# EAGLE design Netfrequency (EAGLE 6.1)
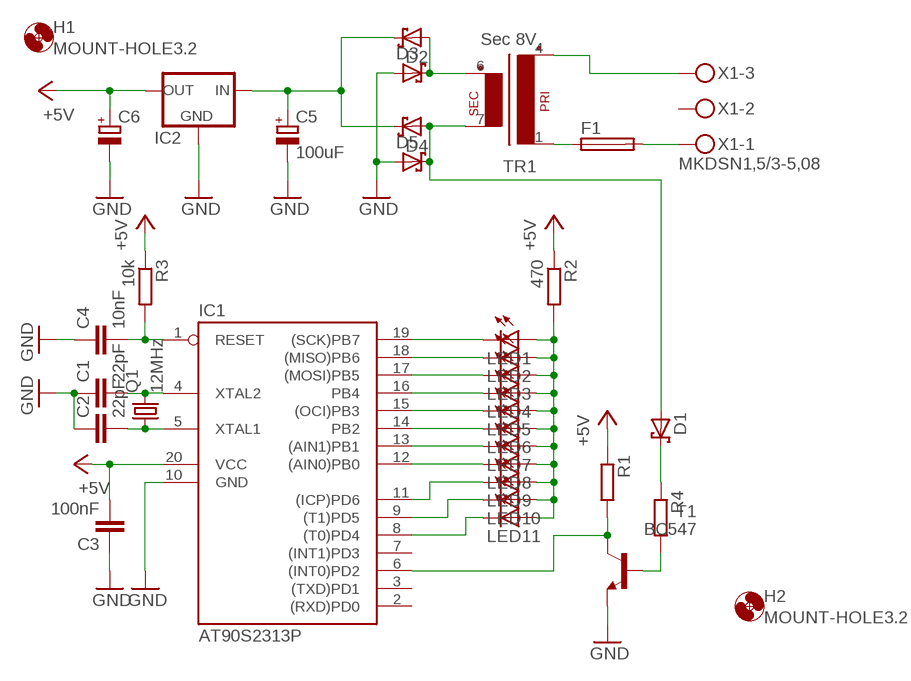
[diagram p0: schematic, sheet 1]

## Parts
C1  22pF  C-EU025-025X050  [C025-025X050]
C2  22pF  C-EU025-025X050  [C025-025X050]
C3  100nF  C-EU025-025X050  [C025-025X050]
C4  10nF  C-EU025-025X050  [C025-025X050]
C5  100uF  CPOL-EUE5-8.5  [E5-8,5]
C6  CPOL-EUE2.5-6  [E2,5-6]
D1  SCHOTTKY-DIODEDO35-7  [DO35-7]
D2  SCHOTTKY-DIODEDO35-7  [DO35-7]
D3  SCHOTTKY-DIODEDO35-7  [DO35-7]
D4  SCHOTTKY-DIODEDO35-7  [DO35-7]
D5  SCHOTTKY-DIODEDO35-7  [DO35-7]
F1  SH22  [SH22]
H1  MOUNT-HOLE3.2  [3,2]
H2  MOUNT-HOLE3.2  [3,2]
IC1  AT90S2313P  [DIL20]
IC2  78LXX  [78LXX]
LED1  LEDSQR2X5  [LED2X5]
LED2  LEDSQR2X5  [LED2X5]
LED3  LEDSQR2X5  [LED2X5]
LED4  LEDSQR2X5  [LED2X5]
LED5  LEDSQR2X5  [LED2X5]
LED6  LEDSQR2X5  [LED2X5]
LED7  LEDSQR2X5  [LED2X5]
LED8  LEDSQR2X5  [LED2X5]
LED9  LEDSQR2X5  [LED2X5]
LED10  LEDSQR2X5  [LED2X5]
LED11  LEDSQR2X5  [LED2X5]
Q1  12MHz  CRYSTALHC49S  [HC49/S]
R1  R-EU_0204/7  [0204/7]
R2  470  R-EU_0204/7  [0204/7]
R3  10k  R-EU_0204/7  [0204/7]
R4  R-EU_0204/7  [0204/7]
T1  BC547  [TO92]
TR1  Sec 8V  EE20-1  [EE20-1]
X1  MKDSN1,5/3-5,08  [MKDSN1,5/3-5,08]

## Nets
+5V: C3.2 C6.+ IC1.20(VCC) IC2.OUT R1.1 R2.1 R3.1
GND: C1.1 C2.1 C3.1 C4.1 C5.- C6.- D3.A D5.A IC1.10(GND) IC2.GND T1.1(E)
N$1: IC1.19((SCK)PB7) LED1.K(C)
N$2: IC1.18((MISO)PB6) LED2.K(C)
N$3: IC1.17((MOSI)PB5) LED3.K(C)
N$4: IC1.16(PB4) LED4.K(C)
N$5: IC1.15((OCI)PB3) LED5.K(C)
N$6: IC1.14(PB2) LED6.K(C)
N$7: IC1.13((AIN1)PB1) LED7.K(C)
N$8: IC1.12((AIN0)PB0) LED8.K(C)
N$9: IC1.11((ICP)PD6) LED9.K(C)
N$10: IC1.9((T1)PD5) LED10.K(C)
N$11: IC1.8((T0)PD4) LED11.K(C)
N$12: LED1.A LED2.A LED3.A LED4.A LED5.A LED6.A LED7.A LED8.A LED9.A LED10.A LED11.A R2.2
N$13: C1.2 IC1.4(XTAL2) Q1.2
N$14: C2.2 IC1.5(XTAL1) Q1.1
N$15: C4.2 IC1.1(RESET) R3.2
N$16: IC1.6((INT0)PD2) R1.2 T1.3(C)
N$17: D2.A D3.C TR1.6(S3)
N$19: C5.+ D2.C D4.C IC2.IN
N$20: F1.1 TR1.1
N$21: F1.2 X1.1
N$22: TR1.4(P2) X1.3
N$23: R4.2 T1.2(B)
N$24: D1.C R4.1
N$25: D1.A D4.A D5.C TR1.7(S4)
Unconnected: IC1.2((RXD)PD0) IC1.3((TXD)PD1) IC1.7((INT1)PD3) X1.2

## Library data of the parts
C1-C4 = rcl:C-EU: CAPACITOR, European symbol
C5 C6 = rcl:CPOL-EU: POLARIZED CAPACITOR, European symbol
D1-D5 = diode:SCHOTTKY-DIODE: Schottky Diode
F1 = fuse:SH22: FUSE HOLDER CS PFP30, Schukat; OC_FARNELL: unknown; OC_NEWARK: unknown
H1 H2 = holes:MOUNT-HOLE: MOUNTING HOLE with drill center marker
IC1 = atmel:AT90S2313: MICROCONTROLLER 2 Kbytes FLASH 128 bytes SRAM 128 bytes EEPROM UART; OC_FARNELL: unknown; OC_NEWARK: unknown
IC2 = v-reg:78LXX: VOLTAGE REGULATOR
LED1-LED11 = led:LED: LED OSRAM: - CHIPLED LG R971, LG N971, LY N971, LG Q971, LY Q971, LO R971, LY R971 LH N974, LH R974 LS Q976, LO Q976, LY Q976 LO Q996 - Hyper CHIPLED LW Q18S LB Q993, LB Q99A, LB R99A - SideLED LS A670, LO A670, LY A670, LG A670, LP A670 LB A673, LV A673, LT A673, LW A673 LH A674 LY A675 LS A676, LA A676, LO A676, LY A676, LW A676 LS A679, LY A679, LG A679 - Hyper Micro SIDELED® LS Y876, LA Y876, LO Y876, LY Y876 LT Y87S - SmartLED LW L88C, LW L88S LB L89C, LB L89S, LG L890 LS L89K, LO L89K, LY L89K LS L896, LA L896, LO L896, LY L896 - TOPLED LS T670, LO T670, LY T670, LG T670, LP T670 LSG T670, LSP T670, LSY T670, LOP T670, LYG T670 LG T671, LOG T671, LSG T671 LB T673, LV T673, LT T673, LW T673 LH T674 LS T676, LA T676, LO T676, LY T676, LB T676, LH T676, LSB T676, LW T676 LB T67C, LV T67C, LT T67C, LS T67K, LO T67K, LY T67K, LW E67C LS E67B, LA E67B, LO E67B, LY E67B, LB E67C, LV E67C, LT E67C LW T67C LS T679, LY T679, LG T679 LS T770, LO T770, LY T770, LG T770, LP T770 LB T773, LV T773, LT T773, LW T773 LH T774 LS E675, LA E675, LY E675, LS T675 LS T776, LA T776, LO T776, LY T776, LB T776 LHGB T686 LT T68C, LB T68C - Hyper Mini TOPLED® LB M676 - Mini TOPLED Santana® LG M470 LS M47K, LO M47K, LY M47K Source: http://www.osram.convergy.de LUXEON: - LUMILED® LXK2-PW12-R00, LXK2-PW12-S00, LXK2-PW14-U00, LXK2-PW14-V00 LXK2-PM12-R00, LXK2-PM12-S00, LXK2-PM14-U00 LXK2-PE12-Q00, LXK2-PE12-R00, LXK2-PE12-S00, LXK2-PE14-T00, LXK2-PE14-U00 LXK2-PB12-K00, LXK2-PB12-L00, LXK2-PB12-M00, LXK2-PB14-N00, LXK2-PB14-P00, LXK2-PB14-Q00 LXK2-PR12-L00, LXK2-PR12-M00, LXK2-PR14-Q00, LXK2-PR14-R00 LXK2-PD12-Q00, LXK2-PD12-R00, LXK2-PD12-S00 LXK2-PH12-R00, LXK2-PH12-S00 LXK2-PL12-P00, LXK2-PL12-Q00, LXK2-PL12-R00 Source: www.luxeon.com KINGBRIGHT: KA-3528ASYC Source: www.kingbright.com
Q1 = crystal:CRYSTAL: CRYSTAL; OC_FARNELL: 1667008; OC_NEWARK: unknown
R1-R4 = rcl:R-EU_: RESISTOR, European symbol
T1 = transistor:BC547: NPN TRANSISTOR
TR1 = trafo:EE20-1: TRANSFORMER 1 primary winding, 1 secondary winding ERA
X1 = con-phoenix-508:MKDSN1,5/3-5,08: MKDSN 1,5/ 3-5,08 Printklemme Nennstrom: 13,5 A Nennspannung: 250 V Rastermaß: 5,08 mm Polzahl: 3 Anschlussart: Schraubanschluss Montage: Löten Anschlussrichtung Leiter/Platine: 0 ° Artikelnummer: 1729131 Source: http://eshop.phoenixcontact.com .. 1729131.pdf; MPN: SMKDSN1,5/3-5,08; OC_FARNELL: 1792904; OC_NEWARK: 70R0299

## Board
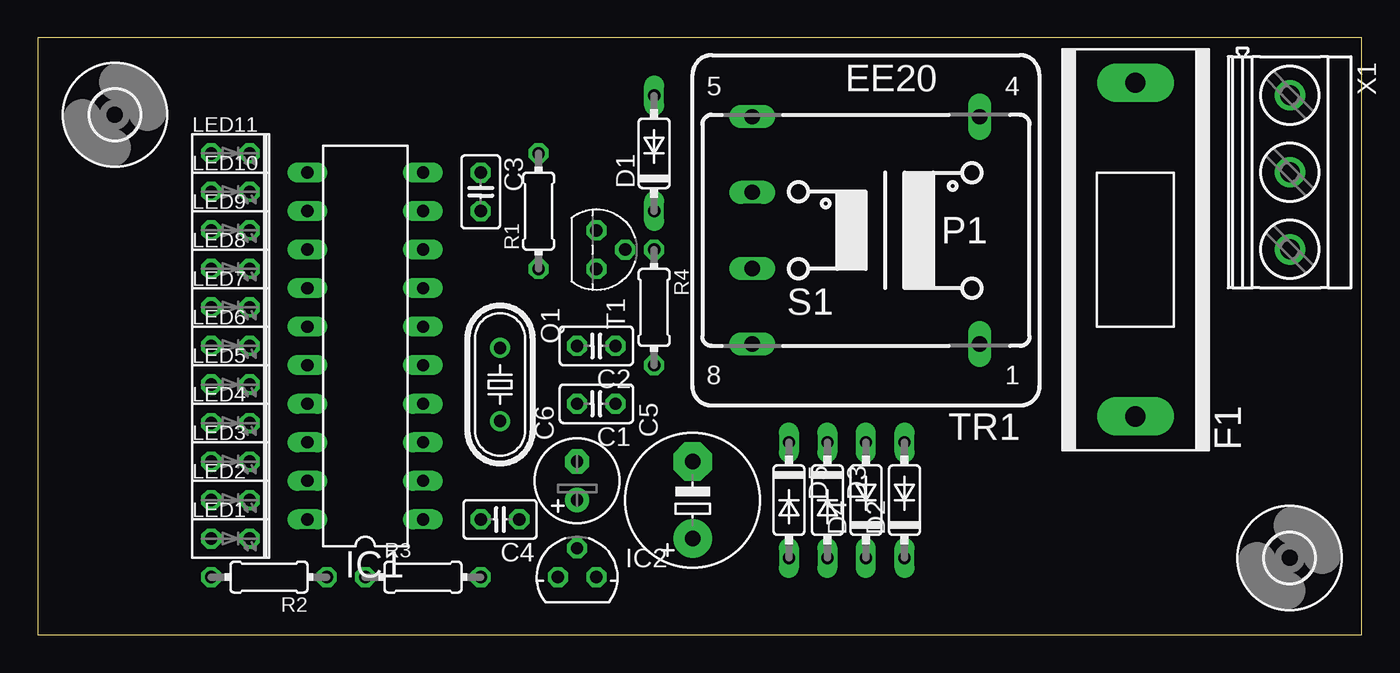
[diagram p1: board, top side]
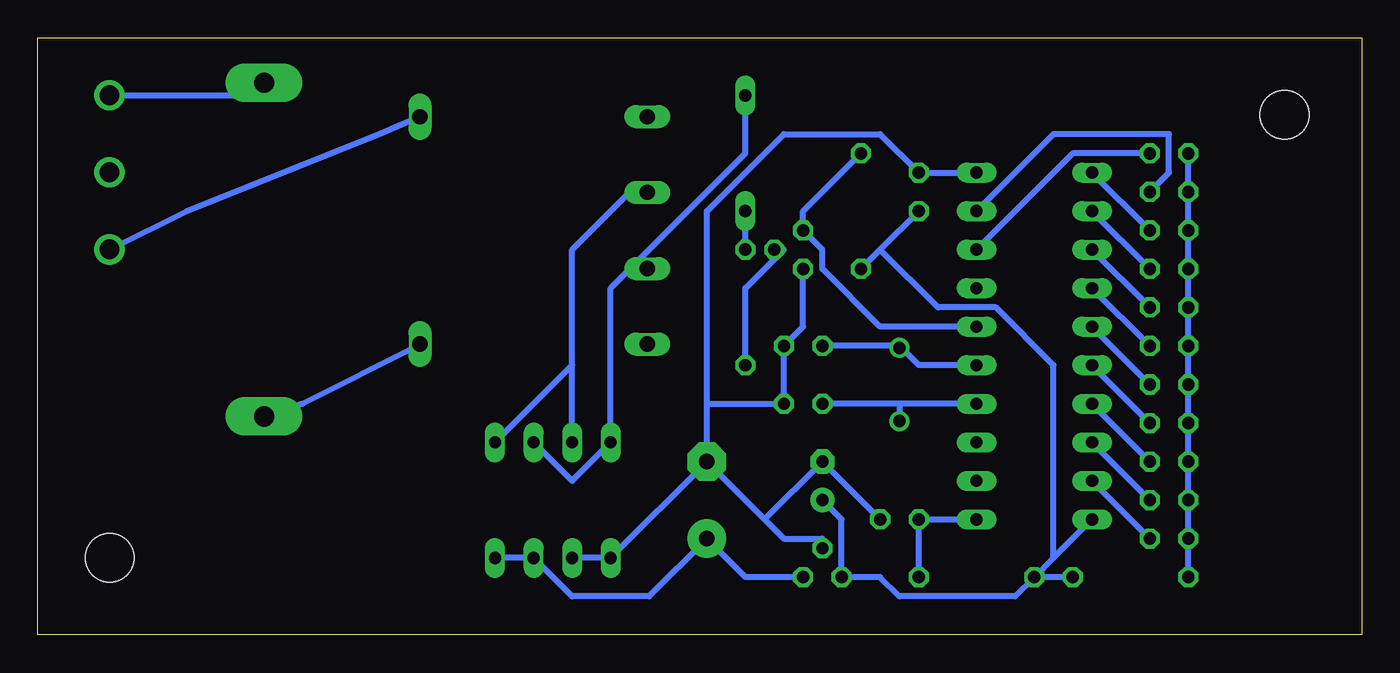
[diagram p2: board, bottom side, seen from below]

Size 87.3 x 39.36 mm. Coordinates in mm from the lower left corner, seen from the top.
Outline: 0,0 87.3,0 87.3,39.36 0,39.36 0,0
Copper layers (1*16): Top 0.035mm / dielectric 1.5mm / Bottom 0.035mm
Design rules: minimum track width 16mil, minimum drill 24mil, track to track 16mil, track to pad 16mil, pad to pad 16mil, via to via 16mil, smd to smd 8mil, copper to edge 40mil, drill to drill 16mil, minimum pad ring 10mil, minimum via ring 8mil, stop-mask expansion 4mil, vias tented up to drill 0mil, thermal gap 10mil

### Footprints (pad centres in the part's own frame; a part is rotated, then mirrored left to right if it is on the bottom)
C025-025X050 = drill 0.813 octagon: 1 -1.27,0; 2 1.27,0
E5-8,5 = drill 1.016 pad 2.54: + -2.54,0 | drill 1.016 pad 2.54 octagon: - 2.54,0
E2,5-6 = drill 0.813 pad 1.6: + -1.27,0 | drill 0.813 pad 1.6 octagon: - 1.27,0
DO35-7 = drill 0.813 long: A 3.81,0; C -3.81,0
SH22 = drill 1.321 pad 2.54 long: 1 -10.998,0; 2 10.998,0
3,2 = hole 3.2: 0,0
DIL20 = drill 0.813 long: 1 -11.43,-3.81; 2 -8.89,-3.81; 3 -6.35,-3.81; 4 -3.81,-3.81; 5 -1.27,-3.81; 6 1.27,-3.81; 7 3.81,-3.81; 8 6.35,-3.81; 9 8.89,-3.81; 10 11.43,-3.81; 11 11.43,3.81; 12 8.89,3.81; 13 6.35,3.81; 14 3.81,3.81; 15 1.27,3.81; 16 -1.27,3.81; 17 -3.81,3.81; 18 -6.35,3.81; 19 -8.89,3.81; 20 -11.43,3.81
78LXX = drill 0.813 octagon: GND 0,1.905; IN 1.27,0; OUT -1.27,0
LED2X5 = drill 0.813 octagon: A -1.27,0; K 1.27,0
HC49/S = drill 0.813: 1 -2.413,0; 2 2.413,0
0204/7 = drill 0.813 octagon: 1 -3.81,0; 2 3.81,0
TO92 = drill 0.813 octagon: 1 1.27,0; 2 0,1.905; 3 -1.27,0
EE20-1 = drill 1.016 long: 1 -7.493,7.493; 4 -7.493,-7.493; 5 7.493,-7.493; 6 7.493,-2.515; 7 7.493,2.515; 8 7.493,7.493
MKDSN1,5/3-5,08 = drill 1.3 pad 2: 1 -7.641,0.025; 2 -2.561,0.025; 3 2.519,0.025

### Placement (x,y rotation side)
C1  36.83,15.24 180 top
C2  36.83,19.05 180 top
C3  29.21,29.21 270 top
C4  30.48,7.62 180 top
C5  43.18,8.89 90 top
C6  35.56,10.16 90 top
D1  40.64,31.75 90 top
D2  57.15,8.89 90 top
D3  52.07,8.89 270 top
D4  54.61,8.89 90 top
D5  49.53,8.89 270 top
F1  72.39,25.4 90 top
H1  5.08,34.29 0 top
H2  82.55,5.08 0 top
IC1  21.59,19.05 90 top
IC2  35.56,3.81 0 top
LED1  12.7,6.35 0 top
LED2  12.7,8.89 0 top
LED3  12.7,11.43 0 top
LED4  12.7,13.97 0 top
LED5  12.7,16.51 0 top
LED6  12.7,19.05 0 top
LED7  12.7,21.59 0 top
LED8  12.7,24.13 0 top
LED9  12.7,26.67 0 top
LED10  12.7,29.21 0 top
LED11  12.7,31.75 0 top
Q1  30.48,16.51 270 top
R1  33.02,27.94 90 top
R2  15.24,3.81 180 top
R3  25.4,3.81 0 top
R4  40.64,21.59 270 top
T1  36.83,25.4 270 top
TR1  54.61,26.67 180 top
X1  82.55,27.94 270 top

### Tracks (layer width: path | path; a pad name or v marks a point on that pad's centre or on a via)
+5V
  Bottom 0.406: 31.75,25.4 C3.2 | 31.75,25.4 R1.1 | C6.+ 34.29,7.62 IC2.OUT 31.75,3.81 30.48,2.54 22.86,2.54 R3.1 | R2.1 R3.1 | R3.1 20.32,5.08 | 20.32,5.08 IC1.20 | 31.75,25.4 27.94,21.59 24.13,21.59 20.32,17.78 20.32,5.08
GND
  Bottom 0.406: T1.1 36.83,20.32 C2.1 C1.1 43.18,15.24 | C4.1 C6.- 39.37,7.62 | IC1.10 C3.1 31.75,33.02 38.1,33.02 43.18,27.94 43.18,15.24 | D3.A D5.A C5.- | 39.37,7.62 C5.- | 39.37,7.62 38.1,6.35 35.56,6.35 IC2.GND | C5.- 43.18,15.24
N$1
  Bottom 0.406: LED1.K IC1.19
N$2
  Bottom 0.406: LED2.K IC1.18
N$3
  Bottom 0.406: LED3.K IC1.17
N$4
  Bottom 0.406: LED4.K IC1.16
N$5
  Bottom 0.406: LED5.K IC1.15
N$6
  Bottom 0.406: LED6.K IC1.14
N$7
  Bottom 0.406: LED7.K IC1.13
N$8
  Bottom 0.406: LED8.K IC1.12
N$9
  Bottom 0.406: LED9.K IC1.11
N$10
  Bottom 0.406: IC1.9 20.32,33.02 12.7,33.02 12.7,30.48 LED10.K
N$11
  Bottom 0.406: LED11.K 19.05,31.75 IC1.8
N$12
  Bottom 0.406: LED11.A LED10.A LED9.A LED8.A LED7.A LED6.A LED5.A LED4.A LED3.A LED2.A LED1.A R2.2
N$13
  Bottom 0.406: 30.48,15.24 C1.2 | IC1.4 30.48,15.24 | 30.48,15.24 Q1.2 30.48,13.97
N$14
  Bottom 0.406: IC1.5 29.21,17.78 30.48,19.05 | 30.48,19.05 C2.2 | 30.48,19.05 Q1.1
N$15
  Bottom 0.406: R3.2 C4.2 IC1.1
N$16
  Bottom 0.406: IC1.6 31.75,20.32 35.56,24.13 35.56,25.4 T1.3 36.83,27.94 R1.2
N$17
  Bottom 0.406: 52.07,17.78 52.07,25.4 48.26,29.21 TR1.6 | D3.C 52.07,17.78 | 52.07,17.78 D2.A
N$19
  Bottom 0.406: D2.C D4.C 52.07,2.54 46.99,2.54 C5.+ 40.64,3.81 IC2.IN
N$20
  Bottom 0.406: TR1.1 62.23,19.05 69.85,15.24 F1.1
N$21
  Bottom 0.406: X1.1 82.55,35.56 72.39,35.56 F1.2
N$22
  Bottom 0.406: TR1.4 64.77,33.02 77.47,27.94 82.55,25.4 X1.3
N$23
  Bottom 0.406: R4.2 40.64,22.86 38.1,25.4 T1.2
N$24
  Bottom 0.406: R4.1 D1.C
N$25
  Bottom 0.406: D1.A 40.64,31.75 48.26,24.13 | 48.26,24.13 49.53,22.86 D5.C 52.07,10.16 D4.A | 48.26,24.13 TR1.7